# Altium project Hydrophones_FrontEnd_Module_1.PrjPcb
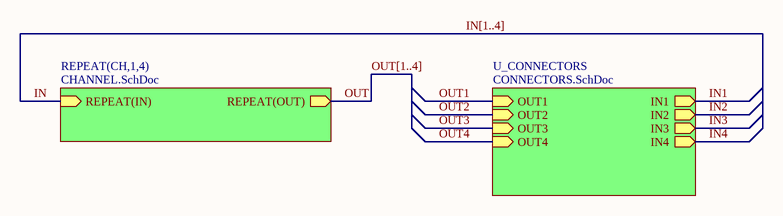
[diagram p0: BOARD.SchDoc]
2 sheets, 56 parts. Net scope: hierarchical (ports join the sheet entries above them; power ports are global).
Board file: BOARD.PcbDoc
Sheets:
  BOARD.SchDoc
    CH1 = CHANNEL.SchDoc
    CH2 = CHANNEL.SchDoc
    CH3 = CHANNEL.SchDoc
    CH4 = CHANNEL.SchDoc

## Sheet BOARD.SchDoc
size A

### Sub-sheets
REPEAT(CH,1,4) = CHANNEL.SchDoc: REPEAT(IN) (in), REPEAT(OUT) (out)
U_CONNECTORS = CONNECTORS.SchDoc (file not in this document): IN1 (out), IN2 (out), IN3 (out), IN4 (out), OUT1 (in), OUT2 (in), OUT3 (in), OUT4 (in)

### Nets
IN: sheet REPEAT(CH,1,4)/REPEAT(IN)
OUT: sheet REPEAT(CH,1,4)/REPEAT(OUT)

### Buses and harness runs
bus IN[1..4]
bus OUT[1..4]

## Sheet CHANNEL.SchDoc: Hydrophones FrontEnd Module 1
size A; DrawnBy: Michael Marques; Engineer: Michael Marques; Revision: 3; ProjectName: Hydrophones FrontEnd Module 1
Used 4 times, as channels CH1, CH2, CH3, CH4. Parts and nets are listed once, with the designators drawn on the sheet.
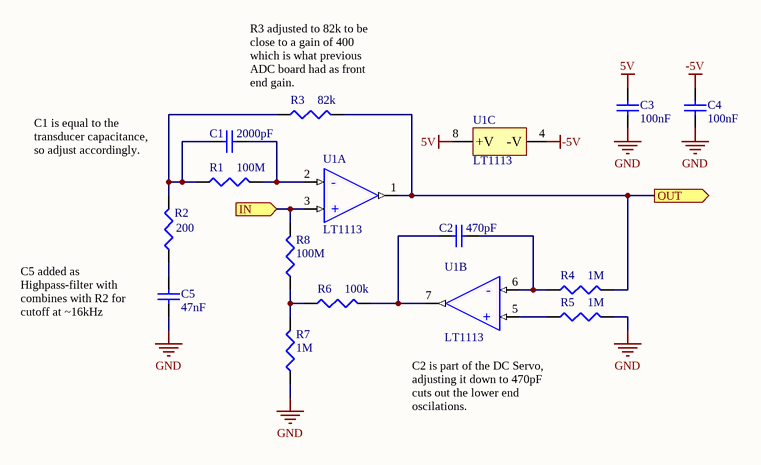
[diagram p1: CHANNEL.SchDoc]

### Parts
C1  value 2000pF  [1608[0603]]  (hidden comment: Cap Semi)
C2  value 470pF  [1608[0603]]  (hidden comment: Cap Semi)
C3  value 100nF  [1608[0603]]  (hidden comment: Cap Semi)
C4  value 100nF  [1608[0603]]  (hidden comment: Cap Semi)
C5  value 47nF  [1608[0603]]  (hidden comment: Cap Semi)
R1  value 100M  [J1-0603]  (hidden comment: Res3)
R2  value 200  [J1-0603]  (hidden comment: Res3)
R3  value 82k  [J1-0603]  (hidden comment: Res3)
R4  value 1M  [J1-0603]  (hidden comment: Res3)
R5  value 1M  [J1-0603]  (hidden comment: Res3)
R6  value 100k  [J1-0603]  (hidden comment: Res3)
R7  value 1M  [J1-0603]  (hidden comment: Res3)
R8  value 100M  [J1-0603]  (hidden comment: Res3)
U1  LT1113  [SO8_L]  (parts A,B,C of 3)

### Ports
IN (in), OUT (out)

### Nets
5V: C3.2 U1.8(+V)
-5V: C4.2 U1.4(-V)
GND: C3.1 C4.1 C5.1 R5.2 R7.1
IN: R8.2 U1.3(+) ; port IN
OUT: R3.2 R4.2 U1.1(OUTA) ; port OUT
NetC1_1: C1.1 R1.1 R2.2 R3.1
NetC1_2: C1.2 R1.2 U1.2(-)
NetC2_1: C2.1 R6.2 U1.7(OUTA)
NetC2_2: C2.2 R4.1 U1.6(-)
NetC5_2: C5.2 R2.1
NetR5_1: R5.1 U1.5(+)
NetR6_1: R6.1 R7.2 R8.1

### Channels
CH1: designators end in _CH1; ports IN=IN1 OUT=OUT1
CH2: designators end in _CH2; ports IN=IN2 OUT=OUT2
CH3: designators end in _CH3; ports IN=IN3 OUT=OUT3
CH4: designators end in _CH4; ports IN=IN4 OUT=OUT4

### Notes on the sheet
- (near R3) R3 adjusted to 82k to be close to a gain of 400 which is what previous ADC board had as front end gain.
- C1 is equal to the transducer capacitance, so adjust accordingly.
- C5 added as Highpass-filter with combines with R2 for cutoff at ~16kHz
- C2 is part of the DC Servo, adjusting it down to 470pF cuts out the lower end oscilations.

### Library data of the parts
C1-C5 = Cap Semi: Capacitor (Semiconductor SIM Model); Published: 8-Jun-2000; LatestRevisionDate: 29-May-2009; LatestRevisionNote: IPC-7351 Footprint Added.; PackageReference: C1206; Publisher: Altium Limited; PackageDescription: Chip Capacitor
R1-R8 = Res3: Resistor; Published: 8-Jun-2000; LatestRevisionDate: 29-May-2009; LatestRevisionNote: IPC-7351 Footprint Added.; PackageReference: J1-0603; Publisher: Altium Limited; PackageDescription: Chip Resistor
U1 = LT1113: LT1113 Opamp

## Nets that join several sheets
5V: CH1 (C3_CH1.2 U1_CH1.8), CH2 (C3_CH2.2 U1_CH2.8), CH3 (C3_CH3.2 U1_CH3.8), CH4 (C3_CH4.2 U1_CH4.8)
-5V: CH1 (C4_CH1.2 U1_CH1.4), CH2 (C4_CH2.2 U1_CH2.4), CH3 (C4_CH3.2 U1_CH3.4), CH4 (C4_CH4.2 U1_CH4.4)
GND: CH1 (5 pins), CH2 (5 pins), CH3 (5 pins), CH4 (5 pins)